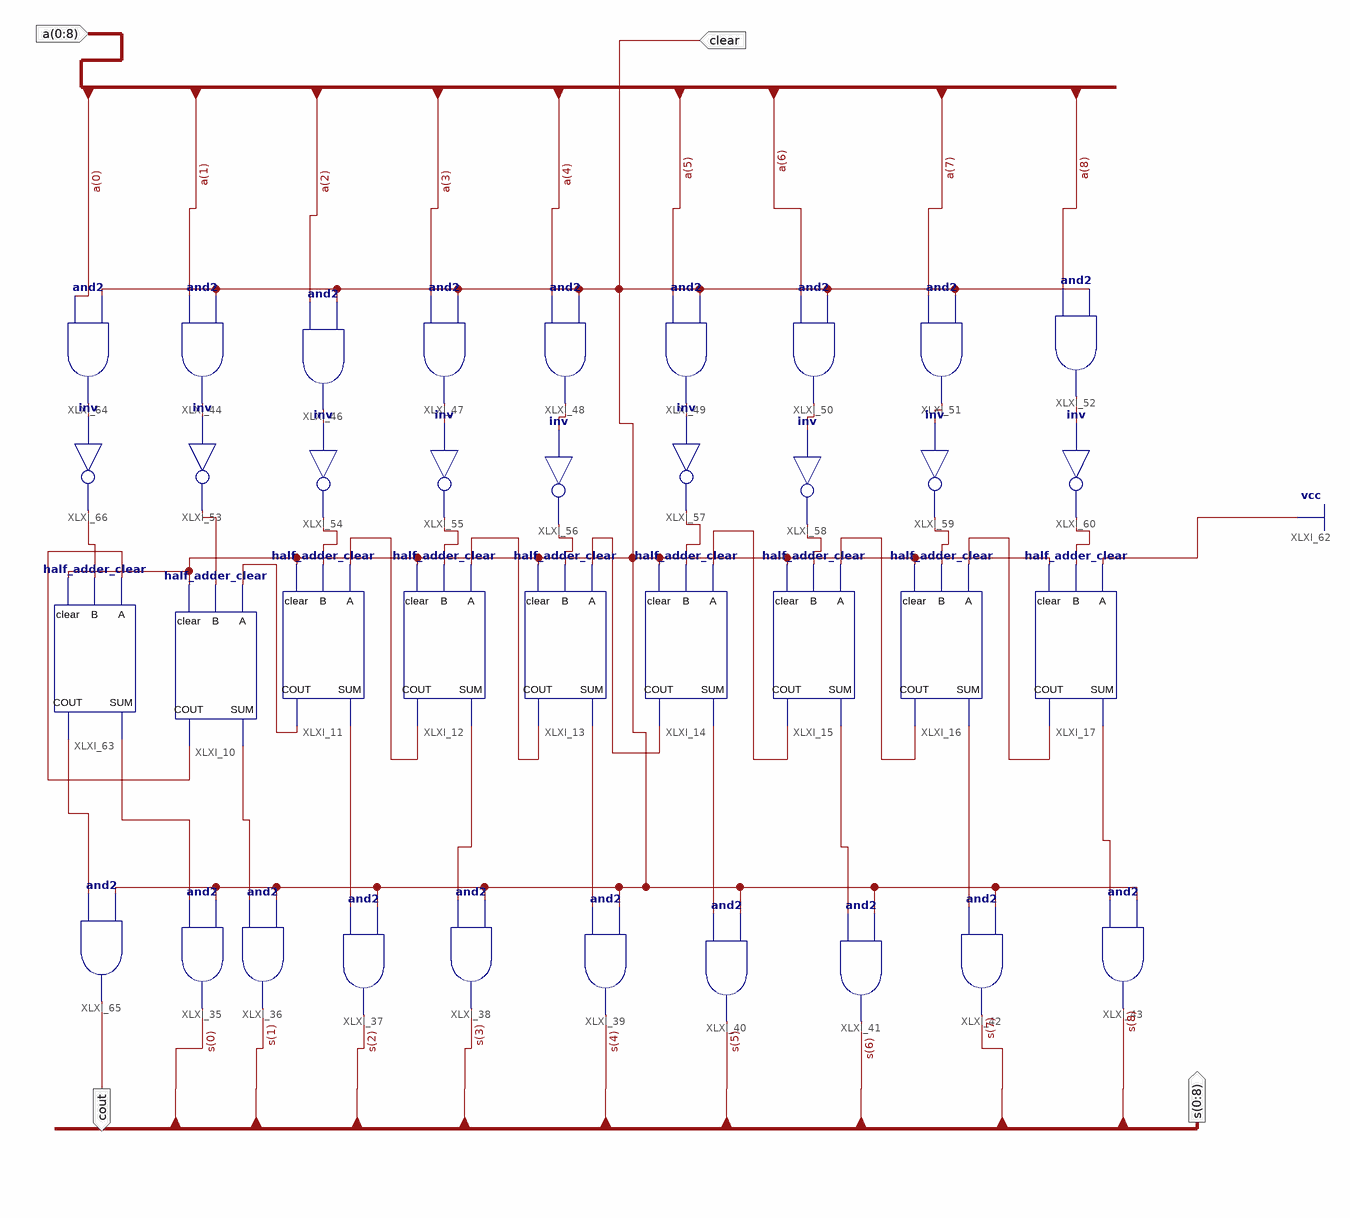
[diagram p0: schematic sheet 1]
// Xilinx ISE schematic complement2s.sch (artix7) as structural Verilog: 37 symbols, 4 ports
module complement2s (
  input  [0:8] a,
  input  clear,
  output [0:8] s,
  output cout
);

  wire XLXN_11, XLXN_12, XLXN_15, XLXN_16, XLXN_17, XLXN_18, XLXN_19, XLXN_21, XLXN_22, XLXN_23, XLXN_24,
       XLXN_37, XLXN_38, XLXN_39, XLXN_40, XLXN_41, XLXN_42, XLXN_43, XLXN_44, XLXN_45, XLXN_62, XLXN_63,
       XLXN_75, XLXN_76, XLXN_77, XLXN_78, XLXN_79, XLXN_80, XLXN_81, XLXN_82, XLXN_98, XLXN_100, XLXN_101,
       XLXN_102, XLXN_103, XLXN_134;

  half_adder_clear XLXI_10 (.A(XLXN_18), .B(XLXN_75), .clear(clear), .SUM(XLXN_134), .COUT(XLXN_98));
  half_adder_clear XLXI_11 (.A(XLXN_17), .B(XLXN_76), .clear(clear), .SUM(XLXN_24), .COUT(XLXN_18));
  half_adder_clear XLXI_12 (.A(XLXN_16), .B(XLXN_77), .clear(clear), .SUM(XLXN_23), .COUT(XLXN_17));
  half_adder_clear XLXI_13 (.A(XLXN_15), .B(XLXN_78), .clear(clear), .SUM(XLXN_22), .COUT(XLXN_16));
  half_adder_clear XLXI_14 (.A(XLXN_37), .B(XLXN_79), .clear(clear), .SUM(XLXN_21), .COUT(XLXN_15));
  half_adder_clear XLXI_15 (.A(XLXN_12), .B(XLXN_80), .clear(clear), .SUM(XLXN_62), .COUT(XLXN_37));
  half_adder_clear XLXI_16 (.A(XLXN_11), .B(XLXN_81), .clear(clear), .SUM(XLXN_19), .COUT(XLXN_12));
  half_adder_clear XLXI_17 (.A(1'b1), .B(XLXN_82), .clear(clear), .SUM(XLXN_63), .COUT(XLXN_11));
  and XLXI_35 (s[0], XLXN_102, clear);
  and XLXI_36 (s[1], XLXN_134, clear);
  and XLXI_37 (s[2], XLXN_24, clear);
  and XLXI_38 (s[3], XLXN_23, clear);
  and XLXI_39 (s[4], XLXN_22, clear);
  and XLXI_40 (s[5], XLXN_21, clear);
  and XLXI_41 (s[6], XLXN_62, clear);
  and XLXI_42 (s[7], XLXN_19, clear);
  and XLXI_43 (s[8], XLXN_63, clear);
  and XLXI_44 (XLXN_38, a[1], clear);
  and XLXI_46 (XLXN_39, a[2], clear);
  and XLXI_47 (XLXN_40, a[3], clear);
  and XLXI_48 (XLXN_41, a[4], clear);
  and XLXI_49 (XLXN_42, a[5], clear);
  and XLXI_50 (XLXN_43, a[6], clear);
  and XLXI_51 (XLXN_44, a[7], clear);
  and XLXI_52 (XLXN_45, a[8], clear);
  not XLXI_53 (XLXN_75, XLXN_38);
  not XLXI_54 (XLXN_76, XLXN_39);
  not XLXI_55 (XLXN_77, XLXN_40);
  not XLXI_56 (XLXN_78, XLXN_41);
  not XLXI_57 (XLXN_79, XLXN_42);
  not XLXI_58 (XLXN_80, XLXN_43);
  not XLXI_59 (XLXN_81, XLXN_44);
  not XLXI_60 (XLXN_82, XLXN_45);
  half_adder_clear XLXI_63 (.A(XLXN_98), .B(XLXN_101), .clear(clear), .SUM(XLXN_102), .COUT(XLXN_103));
  and XLXI_64 (XLXN_100, a[0], clear);
  and XLXI_65 (cout, XLXN_103, clear);
  not XLXI_66 (XLXN_101, XLXN_100);
endmodule
